# EAGLE design l293d_brkout (EAGLE 7.2.0)
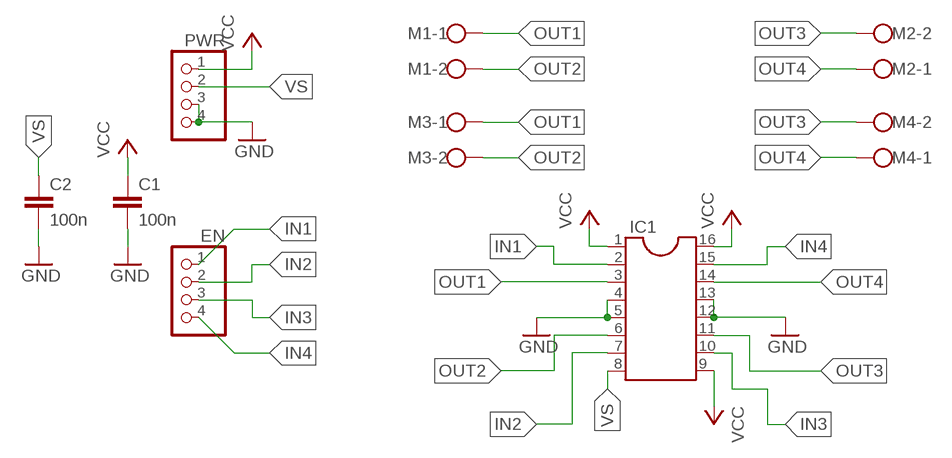
[diagram p0: schematic, sheet 1]

## Parts
C1  100n  C2.5/2  [C2.5-2]
C2  100n  C2.5/2  [C2.5-2]
EN  PINHD-1X4  [1X04]
IC1  DIL16S  [SOCKET-16]
M1  W237-102  [W237-102]
M2  W237-102  [W237-102]
M3  W237-102  [W237-102]
M4  W237-102  [W237-102]
PWR  PINHD-1X4  [1X04]

## Nets
GND: C1.2 C2.2 IC1.4 IC1.5 IC1.12 IC1.13 PWR.3 PWR.4
IN1: EN.1 IC1.2
IN2: EN.2 IC1.7
IN3: EN.3 IC1.10
IN4: EN.4 IC1.15
OUT1: IC1.3 M1.1 M3.1
OUT2: IC1.6 M1.2 M3.2
OUT3: IC1.11 M2.2 M4.2
OUT4: IC1.14 M2.1 M4.1
VCC: C1.1 IC1.1 IC1.9 IC1.16 PWR.1
VS: C2.1 IC1.8 PWR.2

## Library data of the parts
C1 C2 = capacitor-wima:C: CAPACITOR naming: grid - package width
EN PWR = pinhead:PINHD-1X4: PIN HEADER
IC1 = ic-package:DIL16: Dual In Line / Socket
M1-M4 = con-wago-500:W237-102: WAGO SCREW CLAMP; MPN: 237-102; OC_FARNELL: unknown; OC_NEWARK: 70K9898

## Board
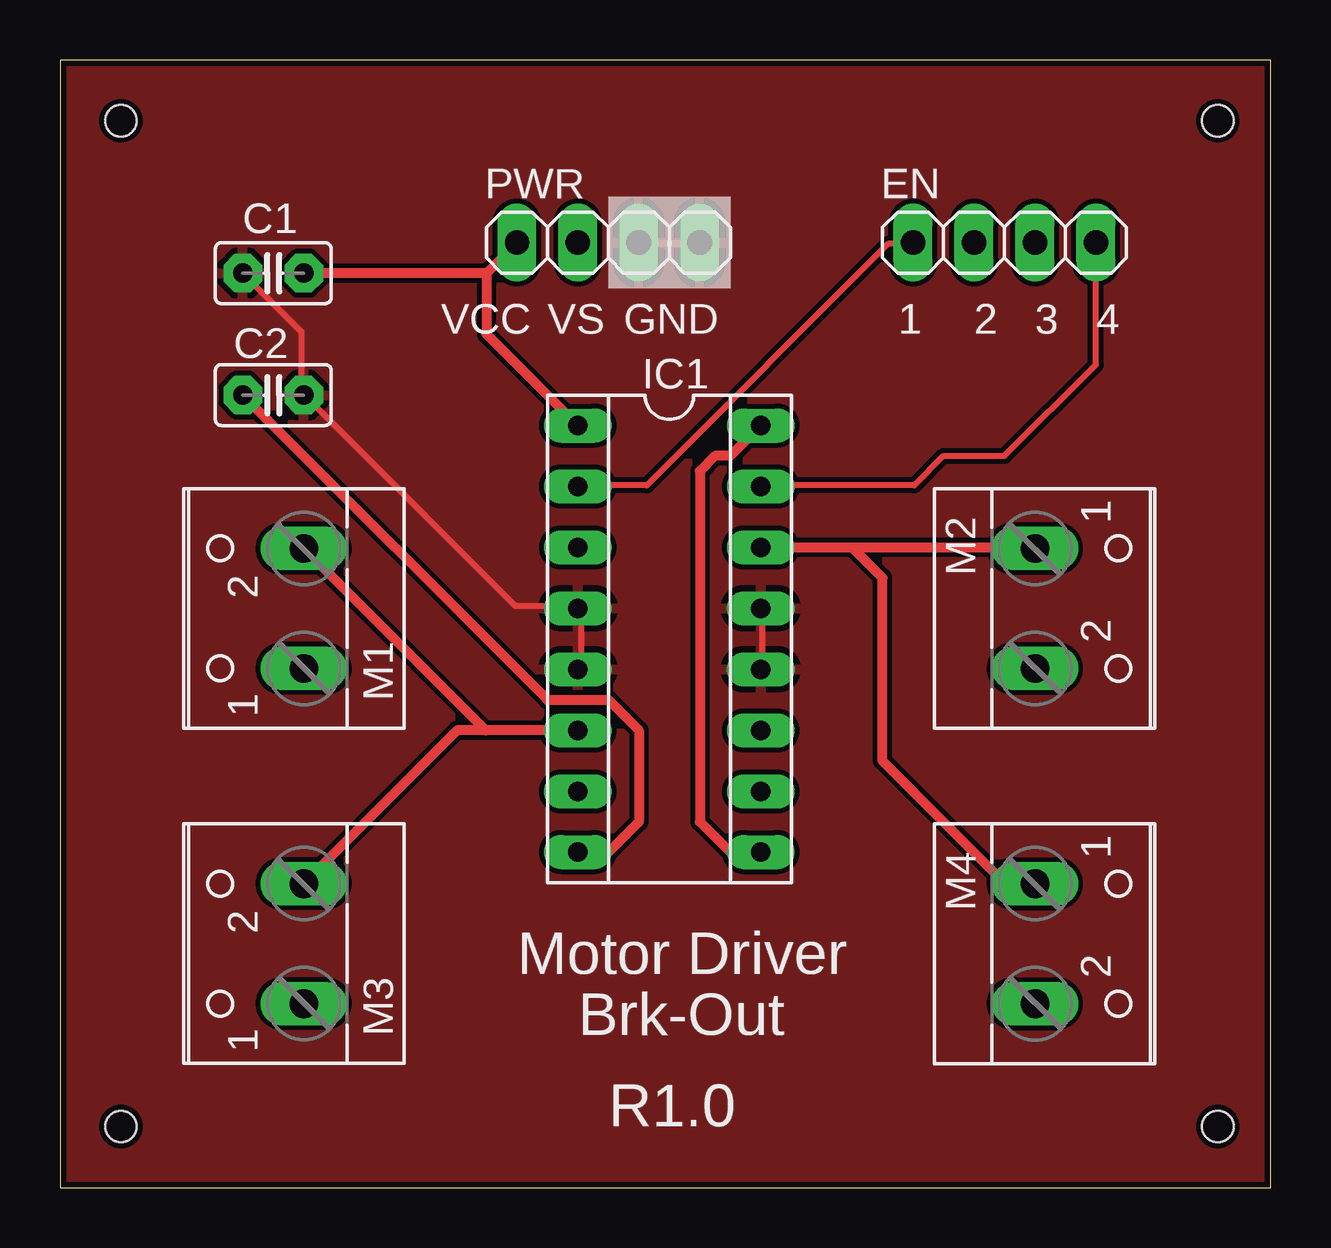
[diagram p1: board, top side]
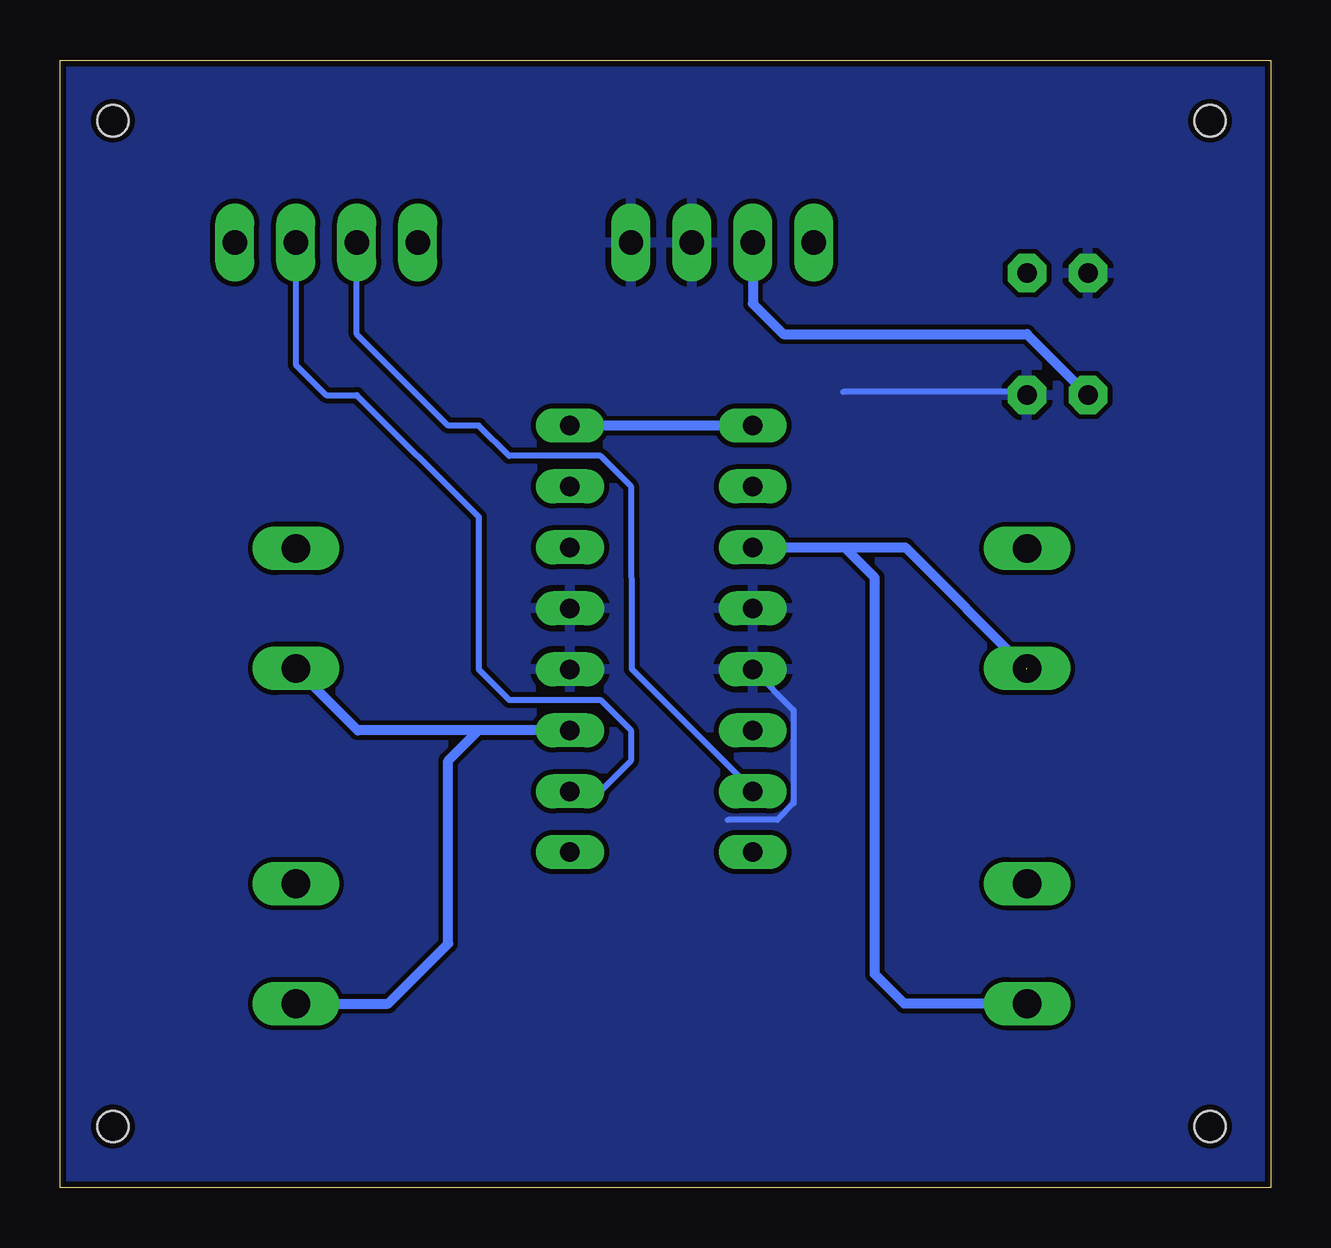
[diagram p2: board, bottom side, seen from below]

Size 50.47 x 46.98 mm. Coordinates in mm from the lower left corner, seen from the top.
Outline: 0,0 50.47,0 50.47,46.98 0,46.98 0,0
Copper layers (1*16): Top 0.035mm / dielectric 1.5mm / Bottom 0.035mm
Design rules "SparkFun": minimum track width 8mil, minimum drill 20mil, track to track 8mil, track to pad 8mil, pad to pad 8mil, via to via 8mil, smd to smd 8mil, copper to edge 10mil, drill to drill 8mil, minimum pad ring 12mil, minimum via ring 10mil, stop-mask expansion 4mil, vias tented up to drill 25mil, thermal gap 10mil
Holes 1.3 mm at 2.54,44.45 48.26,44.45 48.26,2.54 2.54,2.54

### Footprints (pad centres in the part's own frame; a part is rotated, then mirrored left to right if it is on the bottom)
C2.5-2 = drill 0.813 pad 1.6 octagon: 1 -1.27,0; 2 1.27,0
1X04 = drill 1.016 long: 1 -3.81,0; 2 -1.27,0; 3 1.27,0; 4 3.81,0
SOCKET-16 = drill 0.813 long: 1 -8.89,-3.81; 2 -6.35,-3.81; 3 -3.81,-3.81; 4 -1.27,-3.81; 5 1.27,-3.81; 6 3.81,-3.81; 7 6.35,-3.81; 8 8.89,-3.81; 9 8.89,3.81; 10 6.35,3.81; 11 3.81,3.81; 12 1.27,3.81; 13 -1.27,3.81; 14 -3.81,3.81; 15 -6.35,3.81; 16 -8.89,3.81
W237-102 = drill 1.194 long: 1 -2.5,-1.27; 2 2.5,-1.27

### Placement (x,y rotation side)
C1  8.89,38.1 180 top
C2  8.89,33.02 0 top
EN  39.37,39.37 0 top
IC1  25.4,22.86 270 top
M1  8.89,24.13 90 top
M2  41.91,24.13 270 top
M3  8.89,10.16 90 top
M4  41.91,10.16 270 top
PWR  22.86,39.37 0 top

### Tracks (layer width: path | path; a pad name or v marks a point on that pad's centre or on a via)
GND
  Top 0.254: PWR.3 24.23,39.32 26.52,39.32 PWR.4 | IC1.12 29.26,21.72 29.26,24 IC1.13 | IC1.5 21.72,21.72 21.72,24 IC1.4 21.49,24.23 18.97,24.23 10.29,32.92 C2.2 10.06,33.15 10.06,35.66 C1.2
  Bottom 0.254: 28.35,21.03 28.57,21.03 29.03,21.49 IC1.12 | 22.63,15.32 20.57,15.32 19.89,16 19.89,19.89 IC1.5 | 17.83,33.15 10.29,33.15 C2.2 | 24,39.32 PWR.3
  pour Bottom: -1.27,49.53 52.07,49.53 52.07,-3.81 -1.27,-3.81
  pour Top: -1.27,48.26 53.34,48.26 53.34,-2.54 -1.27,-2.54
IN1
  Top 0.254: IC1.2 21.72,29.26 24.46,29.26 34.52,39.32 35.43,39.32 EN.1
IN2
  Bottom 0.254: 37.95,38.41 37.95,39.32 EN.2 38.1,35.56 34.29,31.75 33.02,31.75 31.75,30.48 27.94,30.48 26.67,29.21 26.64,21.61 21.72,16.69 IC1.7
IN3
  Bottom 0.254: EN.3 40.64,34.29 39.37,33.02 38.1,33.02 33.02,27.94 33.02,21.59 31.75,20.32 27.94,20.32 26.67,19.05 26.67,17.78 27.94,16.51 IC1.10
IN4
  Top 0.254: IC1.15 29.26,29.26 35.61,29.26 36.83,30.48 39.37,30.48 43.18,34.29 EN.4 42.98,39.32
OUT1  (1 unrouted)
  Bottom 0.406: IC1.3 17.78,26.67 | 17.78,26.67 15.24,26.67 10.16,21.59 | M3.1 15.28,7.66 16.51,8.89 16.51,25.4 17.78,26.67
OUT2
  Top 0.406: M1.2 17.74,19.05 IC1.6 16.55,19.05 M3.2
OUT3
  Bottom 0.406: IC1.11 33.02,19.05 | 33.02,19.05 38.06,19.05 M2.2 | M4.2 36.79,7.66 34.29,10.16 34.29,17.78 33.02,19.05
OUT4
  Top 0.406: IC1.14 33.02,26.67 | 33.02,26.67 40.6,26.67 M2.1 | M4.1 39.41,12.66 34.29,17.78 34.29,25.4 33.02,26.67
VCC
  Top 0.406: PWR.1 17.78,38.1 | 17.78,38.1 C1.1 | 17.78,38.1 17.78,35.56 IC1.1 | IC1.16 27.94,30.48 27.3,30.48 26.67,29.84 26.67,15.24 27.94,13.97 IC1.9
  Bottom 0.254: 21.72,31.77 IC1.1 | 29.03,31.77 IC1.16
  Bottom 0.406: 21.72,31.77 21.74,31.75 IC1.16
VS
  Top 0.406: C2.1 20.32,20.32 22.86,20.32 24.13,19.05 24.13,15.24 22.86,13.97 IC1.8
  Bottom 0.406: PWR.2 21.59,36.83 20.32,35.56 10.16,35.56 C2.1

### Text on the board
tPlace: VCC | VS | GND | 1 | 2 | 3 | 4 | Motor Driver | Brk-Out | R1.0